# Altium schematic sheet PN532.SchDoc
size A; SheetNumber: 2; SheetTotal: 5
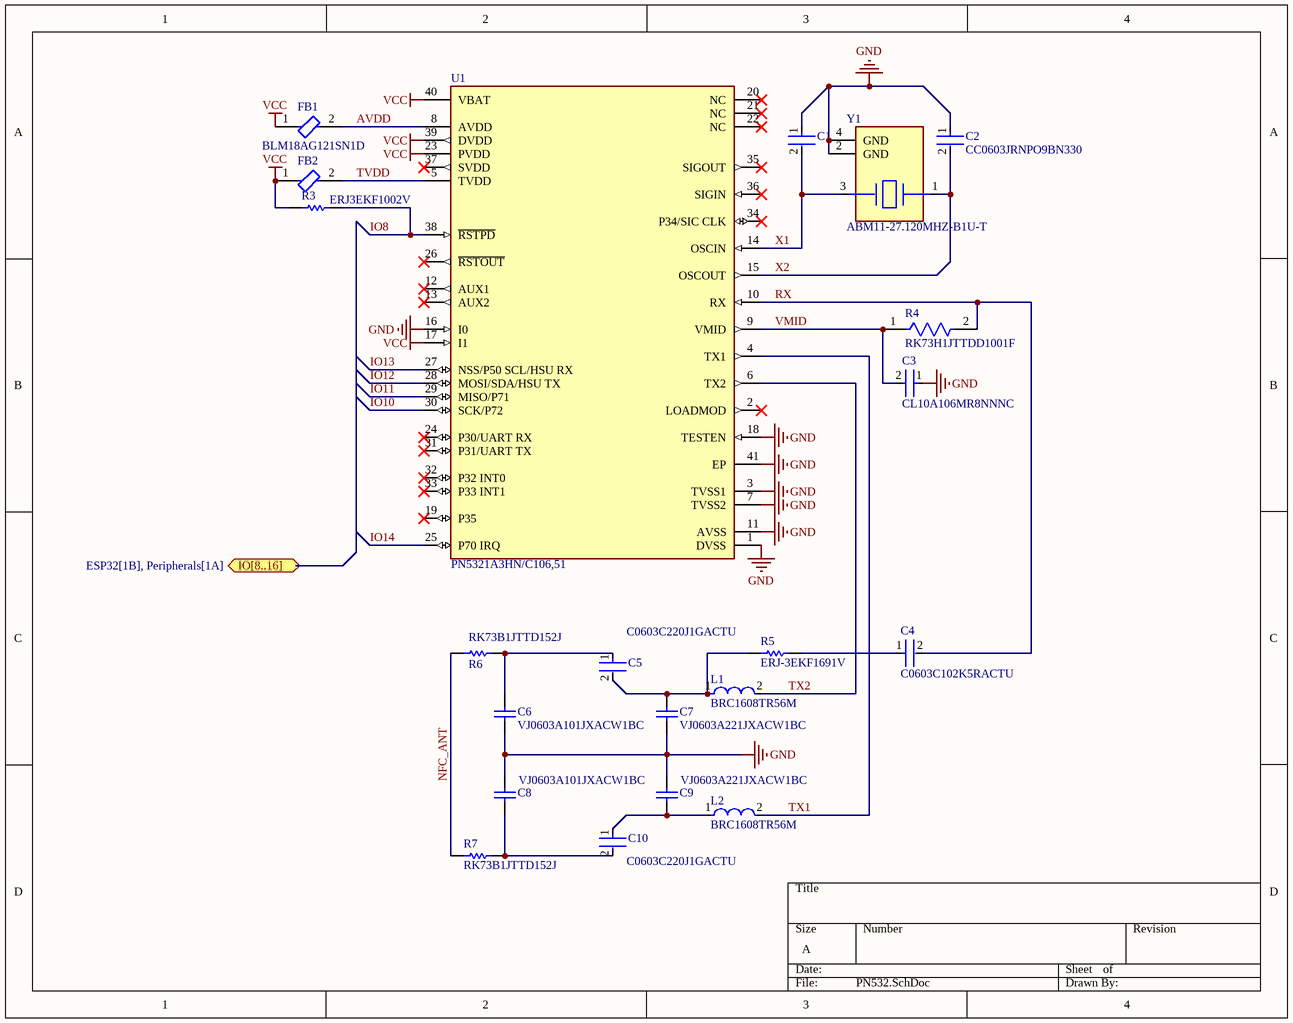
[diagram p0: PN532.SchDoc]

## Parts
C1  CC0603JRNPO9BN330  [FP-CC0603-0_9-IPC_C]  (value not drawn)
C2  CC0603JRNPO9BN330  [FP-CC0603-0_9-IPC_C]
C3  CL10A106MR8NNNC  [FP-CL10-IPC_C]
C4  C0603C102K5RACTU  [FP-C0603C-CF-MFG]
C5  C0603C220J1GACTU  [FP-C0603C-CF-MFG]
C6  VJ0603A101JXACW1BC  [CAPC1608X95X40ML15T15]
C7  VJ0603A221JXACW1BC  [CAPC1608X95X40ML15T15]
C8  VJ0603A101JXACW1BC  [CAPC1608X95X40ML15T15]
C9  VJ0603A221JXACW1BC  [CAPC1608X95X40ML15T15]
C10  C0603C220J1GACTU  [FP-C0603C-CF-MFG]
FB1  BLM18AG121SN1D  [FP-BLM18-0_15-t0_8-IPC_B]
FB2  BLM18AG121SN1D  [FP-BLM18-0_15-t0_8-IPC_B]  (value not drawn)
L1  BRC1608TR56M  [FP-BRC1608-MFG]
L2  BRC1608TR56M  [FP-BRC1608-MFG]
R3  ERJ3EKF1002V  [RESC1609X55X30LL15T15]
R4  RK73H1JTTDD1001F  [FP-RK73H1J-IPC_A]
R5  ERJ-3EKF1691V  [RESC1608X55X30NL15T15]
R6  RK73B1JTTD152J  [RESC1608X55X30LL20T10]
R7  RK73B1JTTD152J  [RESC1608X55X30LL20T10]
U1  PN5321A3HN/C106,51  [FP-SOT618-1-MFG]
Y1  ABM11-27.120MHZ-B1U-T  [FP-ABM11-MFG]

## Ports
IO[8..16] (bidir, see ESP32[1B], Peripherals[1A])

## Nets
GND: C1.1 C2.1 C3.1 C6.1 C7.1 C8.2 C9.2 U1.1(DVSS) U1.3(TVSS1) U1.7(TVSS2) U1.11(AVSS) U1.16(I0) U1.18(TESTEN) U1.41(EP) Y1.2(GND) Y1.4(GND)
VCC: FB1.1 FB2.1 R3.2 U1.17(I1) U1.23(PVDD) U1.39(DVDD) U1.40(VBAT)
AVDD: FB1.2 U1.8(AVDD)
IO8: R3.1 U1.38(~{RSTPD})
IO10: U1.30(SCK/P72)
IO11: U1.29(MISO/P71)
IO12: U1.28(MOSI/SDA/HSU_TX)
IO13: U1.27(NSS/P50_SCL/HSU_RX)
IO14: U1.25(P70_IRQ)
NFC_ANT: R6.1 R7.1
RX: C4.2 R4.2 U1.10(RX)
TVDD: FB2.2 U1.5(TVDD)
TX1: L2.2 U1.4(TX1)
TX2: L1.2 U1.6(TX2)
VMID: C3.2 R4.1 U1.9(VMID)
X1: C1.2 U1.14(OSCIN) Y1.3
X2: C2.2 U1.15(OSCOUT) Y1.1
NetC4_1: C4.1 R5.1
NetC5_1: C5.1 C6.2 R6.2
NetC5_2: C5.2 C7.2 L1.1 R5.2
NetC8_1: C8.1 C10.2 R7.2
NetC9_1: C9.1 C10.1 L2.1

Not connected (* = marked no-connect by the designer): U1 2(LOADMOD)* 12(AUX1)* 13(AUX2)* 19(P35)* 20(NC)* 21(NC)* 22(NC)* 24(P30/UART_RX)* 26(~{RSTOUT})* 31(P31/UART_TX)* 32(P32_INT0)* 33(P33_INT1)* 34(P34/SIC_CLK)* 35(SIGOUT)* 36(SIGIN)* 37(SVDD)*

## Library data of the parts
C1 C2 = CMP-2000-06072-2: CAP CER 33PF 50V C0G/NPO 0603; Tolerance: 5%; Temperature Coefficient: 30ppm/°C; Dielectric: C0G; Insulation Resistance: 100GR; Dielectric Material: Ceramic; Voltage Rating (DC): 50V; Capacitance: 33pF; Voltage: 50V; Resistor Type: Ceramic; Lead Free: Lead Free; Mount: Surface Mount; Case Code (Imperial): 0603; Min Operating Temperature: -55°C; Package Quantity: 1; Case Code (Metric): 1608; Radiation Hardening: No; Packaging: Tape and Reel; Length: 1.6mm; Width: 0.031inch; Termination: SMD/SMT; Max Operating Temperature: 125°C; Series: CC; Case/Package: 0603; RoHS Compliant: Yes; Number of Pins: 2; REACH SVHC: No SVHC; Thickness: 0.035inch; Depth: 0.8mm; Voltage Rating: 50V; Height: 0.8mm
C3 = CMP-13271-001990-1: Cap Ceramic 10uF 4V X5R ±20% Pad SMD 0603 +85°C T/R; Thickness: 0.035inch; Dielectric: X5R; Lead Free: Lead Free; Case Code (Imperial): 0603; Height: 0.8mm; Case Code (Metric): 1608; Voltage Rating (DC): 4V; Length: 1.6mm; Voltage Rating: 4V; Min Operating Temperature: -55°C; Depth: 0.8mm; Mount: Surface Mount; Radiation Hardening: No; Case/Package: 0603; Package Quantity: 1; Packaging: Tape and Reel; Width: 0.031inch; Tolerance: 20%; Max Operating Temperature: 85°C; Capacitance: 10uF
C4 = CMP-2006-03022-3: CAP CER 1000PF 50V X7R 0603; Manufacturer: KEMET; Automotive Grade: Grade 1; Tolerance: 0.1; Value: 1,000 pF; Temperature Coefficient: 30ppm/°C; Material: Ceramic; Temperature Characteristic: X7R; ComponentLink2URL: https://api.kemet.com/component-edge/download/datasheet/C0603C100J5GACAUTO.pdf; Temperature Range Low: -55°C; Capacitance: 1,000 pF; Device Class L2: Capacitors; Device Class L3: Ceramic Capacitors; Device Class L1: Passive Components; Temperature Range High: +125°C; Manufacturer Part Number: C0603C102K5RACTU; Digikey Description: CAP CER 1000PF 50V X7R 0603; Temperature: -55°C to +125°C; Voltage Rating: 50 V; Mouser Description: Capacitor; Ceramic; Cap; 1000pF; Tol 10%; SMT; Vol-Rtg 50V; X7R; Tape and Reel; Automotive: Yes; RoHS: TRUE; Octopart: https://octopart.com/c0603c102k5ractu-kemet-144878; Height: 0.87mm; Package: C0603C-CF; Lead Free: Yes; Category: Cap; ComponentLink2Description: Datasheet
C5 C10 = CMP-2006-03322-2: CAP CER 22PF 100V 5% NP0 0603; Manufacturer: KEMET; Material: Ceramic; Automotive Grade: Grade 1; Temperature Characteristic: C0G; Temperature Coefficient: 30ppm/°C; Tolerance: 0.05; Temperature Range High: +125°C; Capacitance: 22 pF; ComponentLink2URL: https://api.kemet.com/component-edge/download/datasheet/C0603C100J5GACAUTO.pdf; Package: C0603C-CF; Category: Cap; Voltage Rating: 100 V; Automotive: Yes; Mouser Description: Multilayer Ceramic Capacitors MLCC - SMD/SMT 100volts 22pF C0G 5%; Device Class L1: Passive Components; Device Class L3: Ceramic Capacitors; Temperature: -55°C to +125°C; Digikey Description: CAP CER 22PF 100V 5% NP0 0603; RoHS: TRUE; Value: 22 pF; ComponentLink2Description: Datasheet; Height: 0.87mm; Temperature Range Low: -55°C; Manufacturer Part Number: C0603C220J1GACTU; Device Class L2: Capacitors; Octopart: https://octopart.com/c0603c220j1gactu-kemet-9142653; Lead Free: Yes
C6 C8 = CMP-2006-01530-1: Manufacturer: Vitramon; Part Number: VJ0603A101JXACW1BC
C7 C9 = CMP-2006-00030-1: Manufacturer: Vitramon; Part Number: VJ0603A221JXACW1BC
FB1 FB2 = CMP-0686-00439-3: Chip Ferrite Bead, 0603, 120Ω @ 100MHz, 0.18Ω, 25%, 800mA; DC Resistance (DCR): 180mR; Number of Lines: 1; Current Rating: 500mA; Material: Steel; Impedance: 120R; Shielding: Unshielded; Case/Package: 0603; Max Operating Temperature: 125°C; Min Operating Temperature: -55°C; Series: BLM18A; Case Code (Metric): 1608; DC Resistance-Max: 180mR; Package Quantity: 1; Core Material: Ferrite; Radiation Hardening: No; Length: 1.6mm; Lead Free: Lead Free; Max DC Current: 500mA; Termination: SMD/SMT; Number of Pins: 2; Tolerance: 25%; Military Standard: Not; REACH SVHC: No SVHC; Number of Circuits: 1; Test Frequency: 100MHz; Max Current Rating: 500mA; Depth: 0.8mm; Frequency: 100MHz; Width: 0.8mm; Case Code (Imperial): 0603; DC Current: 500mA; Height: 0.8mm; RoHS Compliant: Yes; Packaging: Tape and Reel
L1 L2 = CMP-14484-000012-1: FIXED IND 560NH 760MA 95 MOHM; Tolerance: 20%; Shielding: Unshielded; Test Frequency: 7.96MHz; Self Resonant Frequency: 170MHz; DC Resistance (DCR): 95mR; Core Material: Ferrite; Saturation Current: 1.15A; Inductance Tolerance: 20%; Case Code (Imperial): 0603; Inductance: 560nH; Mount: Surface Mount; Min Operating Temperature: -40°C; Height - Seated (Max): 0.039inch; Halogen Free: Halogen Free; Radiation Hardening: No; REACH SVHC: No SVHC; Termination: SMD/SMT; Height: 0.8mm; Case/Package: 0603; Number of Pins: 2; Package Quantity: 3000; Packaging: Tape and Reel; Current Rating: 760mA; Military Standard: Not; Depth: 1mm; Max DC Current: 760mA; Composition: Wirewound; Max Operating Temperature: 105°C; Case Code (Metric): 1608; Length: 1.6mm; Width: 0.031inch; DC Current: 760mA
R3 = CMP-1012-00623-3: Chip Resistor, 10 KOhm, +/- 1%, 0.1 W, -55 to 155 degC, 0603 (1608 Metric), RoHS, Tape and Reel; Manufacturer: Panasonic; Voltage Rating: 75V; Case\/Package: 0603; Power Rating: 100mW; Resistance: 10KOhm; Temperature Coefficient: 100ppm\/degreesC; Number of Pins: 2; Package Reference: 603; Depth: 0.8mm; Mount: SurfaceMount; Package Description: 2-Pin Surface Mount Device, Body 1.6 x 0.85 mm; Datasheet Version: 02/2017; Length: 1.6mm; Lead Free: LeadFree; Height: 0.45mm; Number of Terminations: 2; Max Power Dissipation: 100mW; Min Operating Temperature: -55degC; Datasheet URL: https://industrial.panasonic.com/cdbs/www-data/pdf/RDA0000/AOA0000C304.pdf; Termination: SMD/SMT; Case Code (Metric): 1608; Case Code (Imperial): 0603; Tolerance: 1%; Max Operating Temperature: 155degC; RoHSCompliant: true; Voltage Rating (DC): 75V; Radiation Hardening: No; Packaging: TapeandReel; Composition: ThickFilm; Mounting Technology: SurfaceMount; Manufacturer URL: http://www.panasonic.com/; Width: 0.031inch; REACH SVHC: NoSVHC; Contact Plating: Tin; Military Standard: Not; Package Quantity: 1
R4 = CMP-2000-01750-2: 1kΩ ±1% 0.125W Chip Resistor 0603 Thick Film AEC-Q200 Qualified; Power Rating: 100mW; Temperature Coefficient: 100ppm/°C; Voltage Rating: 50V; Resistance: 1kR; Max Operating Temperature: 155°C; Min Operating Temperature: -55°C; Depth: 0.8mm; Case/Package: 0603; Length: 1.6mm; Package Quantity: 10000; Construction: Rectangular; Resistor Type: Thick Film; Lead Free: Lead Free; RoHS Compliant: Yes; Military Standard: Not; Case Code (Metric): 1608; Termination: SMD/SMT; Packaging: Tape and Reel; Tolerance: 1%; Width: 0.8mm; Series: RK73H; Case Code (Imperial): 0603; Height: 0.45mm
R5 = CMP-1012-00534-2: Manufacturer: Panasonic; Part Number: ERJ-3EKF1691V
R6 R7 = CMP-2000-01875-1: Manufacturer: KOA Speer; Part Number: RK73B1JTTD152J
U1 = CMP-10150-000009-1: IC RFID RDR/TRAN 13.56MZ 40HVQFN; Manufacturer: NXP Semiconductors; Max Power Dissipation: 500mW; Transmitting Current: 60mA; Data Rate: 424kbits/s; Max Junction Temp: +125°C; Standoff Height: 0mm; Nominal Supply Current: 0.5-60mA; Interface: I2C,SPI,UART; Number Of Adc Channels: 2; Max Frequency: 13.56MHz; Number Of Gpio: 9; Min Supply Voltage: 1.6V; Max Supply Voltage: 5.5V; RoHS: TRUE; Ambient Temperature Range High: +85°C; Temperature Range High: +125°C; Lead Free: Yes; Package: SOT618-1; Temperature Range Low: -40°C; Device Class L1: Integrated Circuits (ICs); Digikey Description: IC RFID RDR/TRAN 13.56MZ 40HVQFN; Octopart: https://octopart.com/pn5321a3hn%2Fc106%2C51-nxp+semiconductors-18453768; Device Class L3: Transceivers; Temperature: -40°C to +125°C; Ipc Land Pattern Name: QFN50P600X600X85-40; Device Class L2: RF Semiconductors and Devices; Footprint Url: https://www.nxp.com/docs/en/package-information/SOT618-1.pdf; Automotive: No; ComponentLink2Description: Datasheet; ComponentLink2URL: https://www.nxp.com/docs/en/nxp/data-sheets/PN532_C1.pdf; Category: IC; Height: 1mm; Mouser Description: PN5321A3HN Series 13.56 MHz RF Reader Analog and Digital Combo - HVQFN-40; Manufacturer Part Number: PN5321A3HN/C106,51; Ambient Temperature Range Low: -30°C
Y1 = CMP-27762-005978-1: Crystal 27.12MHz ±10ppm 10pF SMD-4 2mm x 1.6mm